# EasyEDA Pro project 12-5-3.3 card concept _panther_.epro

# Schematic Schematic1
Board Name: Board1; Create Date: 2025-04-18; Page Name: P1; Project Name: 5V3.3V PWR; Schematic Name: Schematic1; Update Date: 2025-04-18; Company: 嘉立创EDA; Page Size: A4; Version: V1.0
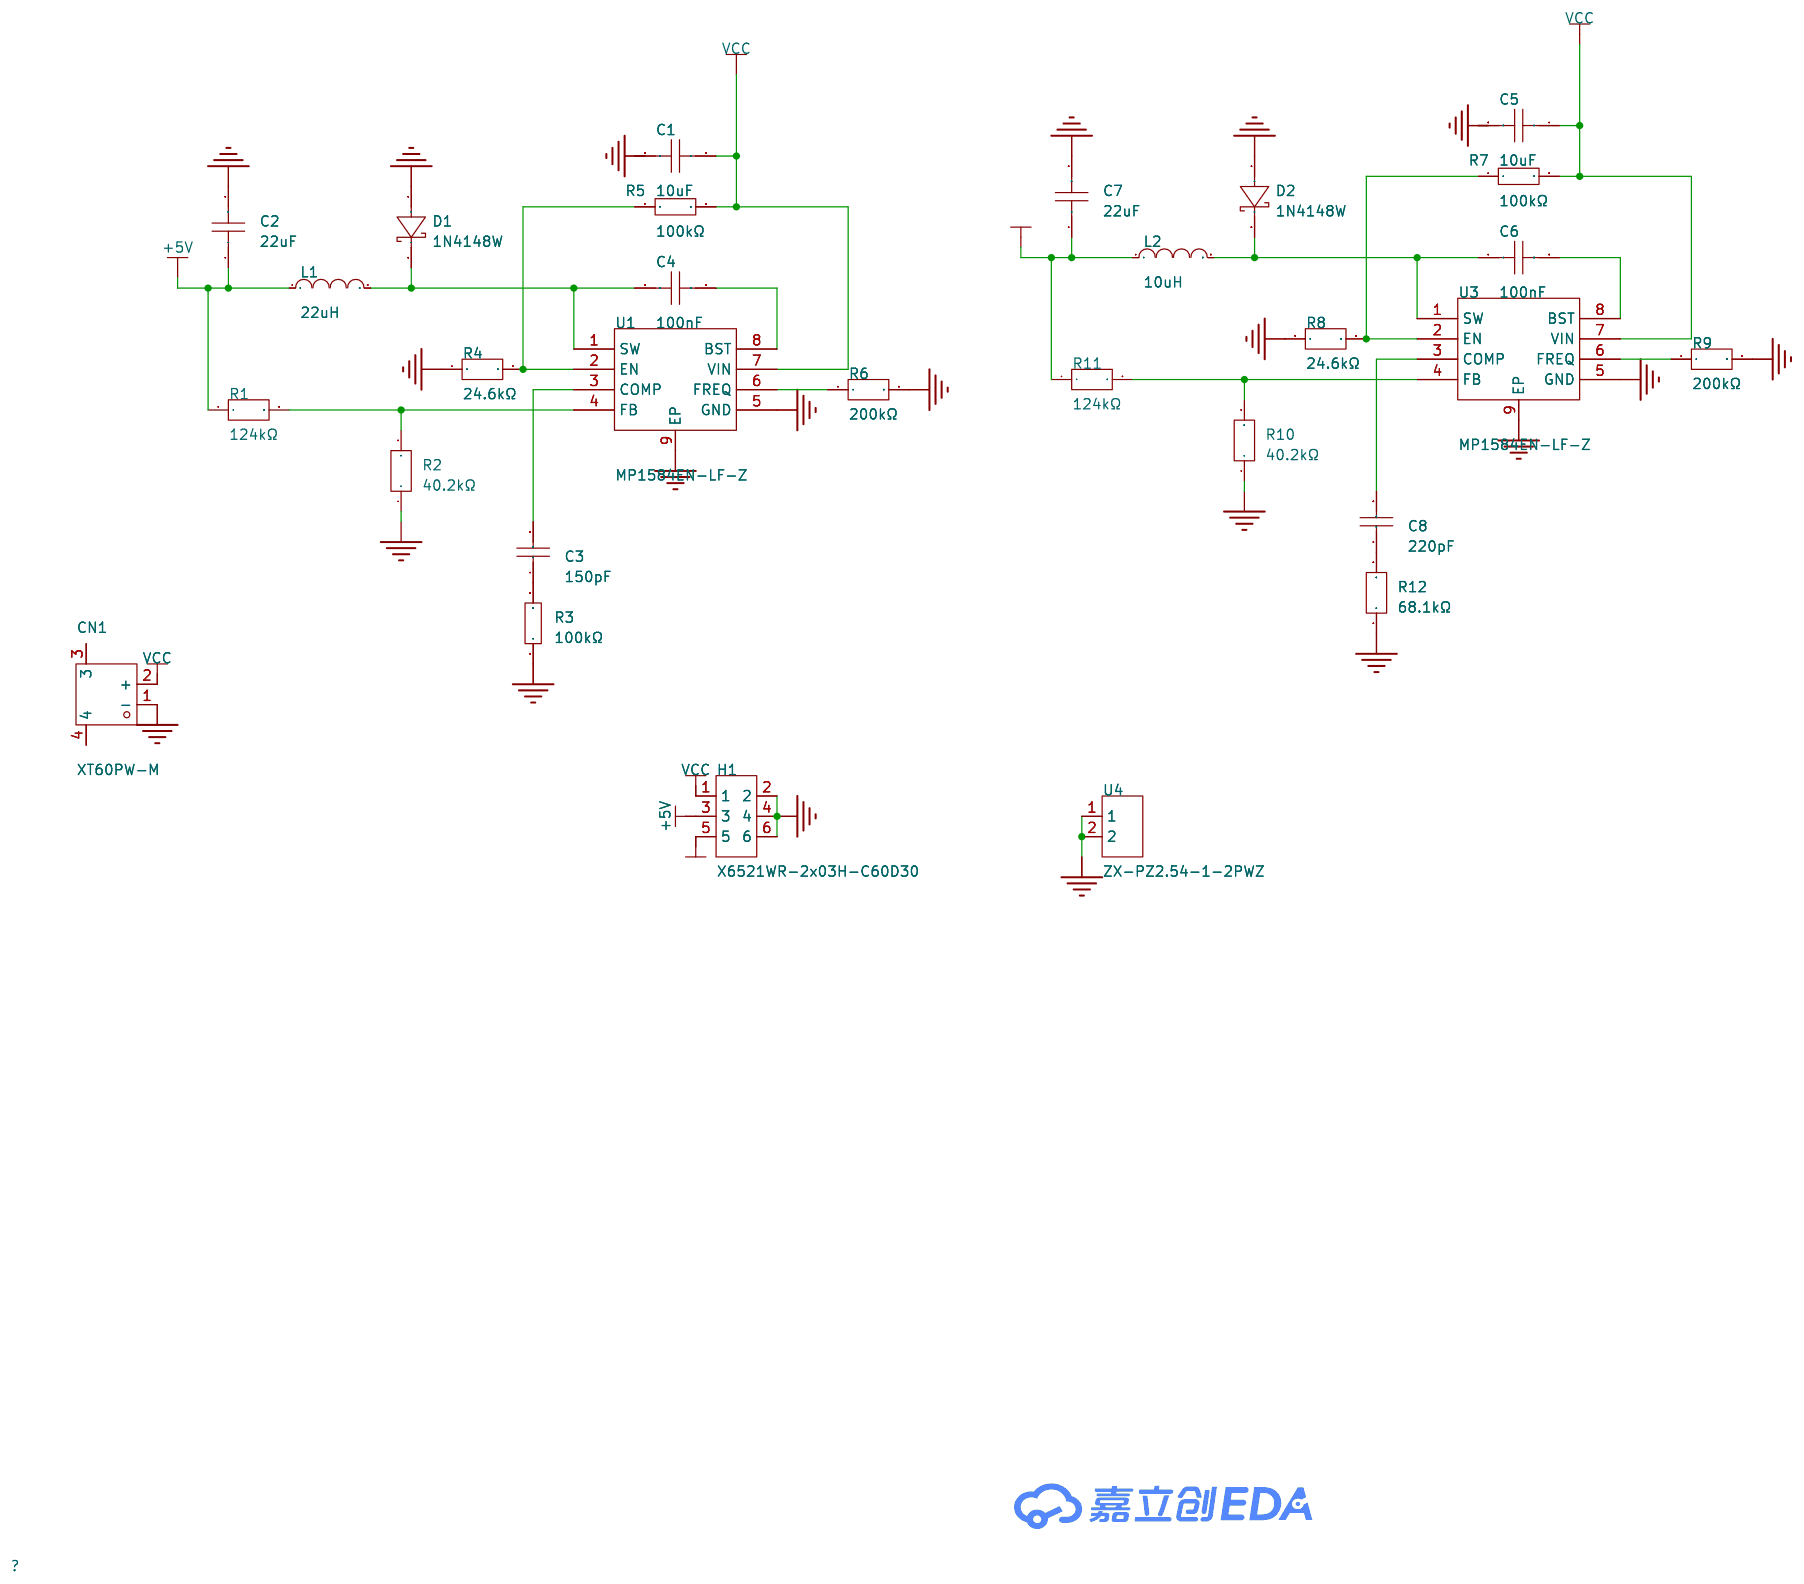
[diagram p0: schematic sheet]

## Parts
C1  10uF  [C1206]
C2  22uF  [C0805]
C3  150pF  [C0603]
C4  100nF  [C0603]
C5  10uF  [C1206]
C6  100nF  [C0603]
C7  22uF  [C0805]
C8  220pF  [C0603]
CN1  XT60PW-M  [CONN-TH_XT60PW-M]
D1  1N4148W  [SOD-123_L2.7-W1.6-LS3.7-FD]
D2  1N4148W  [SOD-123_L2.7-W1.6-LS3.7-FD]
H1  X6521WR-2x03H-C60D30  [HDR-TH_6P-P2.54-H-M-R2-C3-S2.54-W12.3-N]
L1  22uH  [IND-SMD_L7.0-W6.6_FXL0630]
L2  10uH  [IND-SMD_L7.3-W6.8]
R1  124kΩ  [R0603]
R2  40.2kΩ  [R0603]
R3  100kΩ  [R0603]
R4  24.6kΩ  [R0603]
R5  100kΩ  [R0603]
R6  200kΩ  [R0603]
R7  100kΩ  [R0603]
R8  24.6kΩ  [R0603]
R9  200kΩ  [R0603]
R10  40.2kΩ  [R0603]
R11  124kΩ  [R0603]
R12  68.1kΩ  [R0603]
U1  MP1584EN-LF-Z  [SOIC-8_L5.0-W4.0-P1.27-LS6.0-BL-EP2.0]
U3  MP1584EN-LF-Z  [SOIC-8_L5.0-W4.0-P1.27-LS6.0-BL-EP2.0]
U4  ZX-PZ2.54-1-2PWZ  [HDR-TH_2P-P2.54-H-M-W10.4]

## Library data of the parts
C1 C5 = HGC1206R5106K500NSPJ: 容值:10uF;精度:±10%;额定电压:50V;温度系数:X5R;; LCSC Part Name: 10uF ±10% 50V; Supplier Part: C7432781; Manufacturer: Chinocera(华瓷); Supplier Footprint: 1206; JLCPCB Part Class: 扩展库; Datasheet: https://atta.szlcsc.com/upload/public/pdf/source/20240320/FAC3FEC40A78BC5CCCE96C232A94D860.pdf; Supplier: LCSC; Tolerance: ±10%; Voltage Rating: 50V; Temperature Coefficient: X5R
C2 C7 = CGA0805X5R226M350MT: 容值:22uF;精度:±20%;额定电压:35V;材质(温度系数):X5R;; LCSC Part Name: 22uF ±20% 35V; Supplier Part: C6119901; Manufacturer: HRE(芯声); Supplier Footprint: 0805; JLCPCB Part Class: 扩展库; Datasheet: https://atta.szlcsc.com/upload/public/pdf/source/20231129/D589D0CC4D260F7AC3A77E53B455CCB3.pdf; Supplier: LCSC; Tolerance: ±20%; Voltage Rated: 35V; Temperature Coefficient: X5R
C3 = 0603B151K500NT: 容值:150pF;精度:±10%;额定电压:50V;温度系数:X7R;; LCSC Part Name: 150pF ±10% 50V; Supplier Part: C1594; Manufacturer: FH(风华); Supplier Footprint: 0603; JLCPCB Part Class: 基础库; Datasheet: https://atta.szlcsc.com/upload/public/pdf/source/20200305/C486355_26A10D38EF8C2A5C37091D0039909270.pdf; Supplier: LCSC; Tolerance: ±10%; Voltage Rating: 50V; Temperature Coefficient: X7R
C4 C6 = CGA0603X7R104K500JT: 容值:100nF;精度:±10%;额定电压:50V;材质(温度系数):X7R;; LCSC Part Name: 100nF ±10% 50V; Supplier Part: C6119867; Manufacturer: HRE(芯声); Supplier Footprint: 0603; JLCPCB Part Class: 扩展库; Supplier: LCSC; Tolerance: ±10%; Voltage Rated: 50V; Temperature Coefficient: X7R
C8 = CL10B221KB8NNNC: 容值:220pF;精度:±10%;额定电压:50V;材质(温度系数):X7R;; LCSC Part Name: 220pF ±10% 50V; Supplier Part: C1603; Manufacturer: SAMSUNG(三星); Supplier Footprint: 0603; JLCPCB Part Class: 基础库; Datasheet: https://atta.szlcsc.com/upload/public/pdf/source/20160218/1457707763339.pdf; Supplier: LCSC; Tolerance: ±10%; Voltage Rated: 50V; Temperature Coefficient: X7R
CN1 = XT60PW-M: 类别:-;类型1:-;; LCSC Part Name: AMASS(艾迈斯)航模插头xt60连接器150公母对接pw锂电池公头 板插卧式XT60PW-M; Supplier Part: C98732; Manufacturer: AMASS(艾迈斯); JLCPCB Part Class: 扩展库; Datasheet: https://atta.szlcsc.com/upload/public/pdf/source/20240118/44A3DCFF53BE25DC65378AFFB21277A4.pdf; Supplier: LCSC; Brand: 艾迈斯; Type: 卧式插头; Colour: 黄色; InterfaceType: 公头
D1 D2 = 1N4148W_C7420318: 二极管配置:独立式;正向压降(Vf):1.25V@150mA;直流反向耐压(Vr):100V;整流电流:150mA;反向恢复时间(trr):4ns;; Supplier Part: C7420318; Manufacturer: 宏迦橙; Supplier Footprint: SOD-123; JLCPCB Part Class: 扩展库; Datasheet: https://atta.szlcsc.com/upload/public/pdf/source/20230828/E5C3F7A4272052930A7E03B75759BF50.pdf; Supplier: LCSC; Diode Configuration: 独立式; Forward Voltage (Vf@If): 1.25V@150mA; Reverse Voltage (Vr): 100V; Rectified Current: 150mA; Reverse Leakage Current (Ir): 1uA@75V; Reverse Recovery Time (trr): 4ns; Operating Temperature: -55℃~+150℃
H1 = X6521WR-2x03H-C60D30: 插针结构:2x3P;间距:2.54mm;行距:2.54mm;圆针/方针:方针;排数:双排;总PIN位数:6P;额定电流:3A;额定电压:250V;配合针长度:-;塑高:2.5mm;端接针长度:-;触头材质:黄铜;触头镀层:金;工作温度:-40℃~+105℃;颜色:黑色;; LCSC Part Name: 2x3P 间距:2.54mm 方针; Supplier Part: C706884; Manufacturer: XKB Connection(中国星坤); Supplier Footprint: 弯插,P=2.54mm; JLCPCB Part Class: 扩展库; Datasheet: https://atta.szlcsc.com/upload/public/pdf/source/20230629/0A709C32132F66B6F68FAA8EED66C225.pdf; Supplier: LCSC; Pin Structure: 2x3P; Pitch: 2.54mm; Row Spacing: 2.54mm; Circluar Pins/Square Pins: 方针; Number of Rows: 双排; Number of Pins: 6P; Current Rating: 3A; Voltage Rating (Max): 250V; Insulation Height: 2.5mm; Contact Material: 黄铜; Contact Plating: 金; Operating Temperature: -40℃~+105℃; Color: 黑色
L1 = FXL0630-220-M: 电感值:22uH;精度:±20%;额定电流:2.5A;饱和电流(Isat):3A;类型:一体成型电感;; LCSC Part Name: 22uH ±20% 3A; Supplier Part: C177244; Manufacturer: cjiang(长江微电); Supplier Footprint: SMD,6.6x7mm; JLCPCB Part Class: 扩展库; Datasheet: https://atta.szlcsc.com/upload/public/pdf/source/20240426/3189EA8206330E2108542F9E34E540E7.pdf; Supplier: LCSC; Tolerance: ±20%; Rated Current: 2.5A; Saturation Current (Isat): 3A; DC Resistance (DCR): 200mΩ; Type: 一体成型电感
L2 = FXL0630-100-M: 电感值:10uH;精度:±20%;额定电流:4.5A;饱和电流(Isat):5.5A;类型:一体成型电感;; LCSC Part Name: 10uH ±20% 5.5A; Supplier Part: C167223; Manufacturer: cjiang(长江微电); Supplier Footprint: SMD,6.6x7mm; JLCPCB Part Class: Extended Part; Datasheet: https://atta.szlcsc.com/upload/public/pdf/source/20240426/3189EA8206330E2108542F9E34E540E7.pdf; Supplier: LCSC; Tolerance: ±20%; Rated Current: 4.5A; Saturation Current (Isat): 5.5A; DC Resistance (DCR): 68mΩ; Type: 一体成型电感
R1 R11 = FRC0603F1243TS: 电阻类型:厚膜电阻;阻值:124kΩ;精度:±1%;功率:100mW;最大工作电压:75V;温度系数:±100ppm/℃;; LCSC Part Name: 124kΩ ±1% 100mW 厚膜电阻; Supplier Part: C2933136; Manufacturer: FOJAN(富捷); Supplier Footprint: 0603; JLCPCB Part Class: 扩展库; Datasheet: https://atta.szlcsc.com/upload/public/pdf/source/20211221/925EC7D7225764EE0046F22065062C87.pdf; Supplier: LCSC; Type: 厚膜电阻; Tolerance: ±1%; Power(Watts): 100mW; Overload Voltage (Max): 75V; Temperature Coefficient: ±100ppm/℃; Operating Temperature Range: -55℃~+155℃
R2 R10 = FRC0603F4022TS: 电阻类型:厚膜电阻;阻值:40.2kΩ;精度:±1%;功率:100mW;最大工作电压:75V;温度系数:±100ppm/℃;; LCSC Part Name: 40.2kΩ ±1% 100mW 厚膜电阻; Supplier Part: C2933218; Manufacturer: FOJAN(富捷); Supplier Footprint: 0603; JLCPCB Part Class: 扩展库; Datasheet: https://atta.szlcsc.com/upload/public/pdf/source/20211221/925EC7D7225764EE0046F22065062C87.pdf; Supplier: LCSC; Type: 厚膜电阻; Tolerance: ±1%; Power(Watts): 100mW; Overload Voltage (Max): 75V; Temperature Coefficient: ±100ppm/℃; Operating Temperature Range: -55℃~+155℃
R3 R5 R7 = 0603WAF1003T5E: 电阻类型:厚膜电阻;阻值:100kΩ;精度:±1%;功率:100mW;最大工作电压:75V;温度系数:±100ppm/℃;; LCSC Part Name: 100kΩ ±1% 100mW 厚膜电阻; Supplier Part: C25803; Manufacturer: UNI-ROYAL(厚声); Supplier Footprint: 0603; JLCPCB Part Class: 基础库; Datasheet: https://atta.szlcsc.com/upload/public/pdf/source/20200306/C422600_1E6D84923E4A46A82E41ADD87F860B5C.pdf; Supplier: LCSC; Type: 厚膜电阻; Tolerance: ±1%; Power(Watts): 100mW; Overload Voltage (Max): 75V; Temperature Coefficient: ±100ppm/℃; Operating Temperature Range: -55℃~+155℃
R4 R8 = RT0603BRD0724K6L: 电阻类型:薄膜电阻;阻值:24.6kΩ;精度:±0.1%;功率:100mW;温度系数:±25ppm/℃;; LCSC Part Name: 薄膜电阻 24.6kΩ ±0.1% 100mW; Supplier Part: C861250; Manufacturer: YAGEO(国巨); Supplier Footprint: 0603; JLCPCB Part Class: Extended Part; Datasheet: https://atta.szlcsc.com/upload/public/pdf/source/20200610/C326738_5639A9F1B6EB6E4AE2197577D3456E7F.pdf; Supplier: LCSC; Type: 薄膜电阻; Tolerance: ±0.1%; Power(Watts): 100mW; Temperature Coefficient: ±25ppm/℃; Operating Temperature Range: -55℃~+155℃
R6 R9 = FRC0603F2003TS: 电阻类型:厚膜电阻;阻值:200kΩ;精度:±1%;功率:100mW;工作电压:75V;温度系数:±100ppm/℃;; LCSC Part Name: 200kΩ ±1% 100mW 厚膜电阻; Supplier Part: C2907009; Manufacturer: FOJAN(富捷); Supplier Footprint: 0603; JLCPCB Part Class: Extended Part; Datasheet: https://atta.szlcsc.com/upload/public/pdf/source/20211221/925EC7D7225764EE0046F22065062C87.pdf; Supplier: LCSC; Type: 厚膜电阻; Tolerance: ±1%; Power(Watts): 100mW; Voltage-Supply(Max): 75V; Temperature Coefficient: ±100ppm/℃; Operating Temperature: -55℃~+155℃
R12 = FRC0603F6812TS: 电阻类型:厚膜电阻;阻值:68.1kΩ;精度:±1%;功率:100mW;最大工作电压:75V;温度系数:±100ppm/℃;; LCSC Part Name: 68.1kΩ ±1% 100mW 厚膜电阻; Supplier Part: C2933251; Manufacturer: FOJAN(富捷); Supplier Footprint: 0603; JLCPCB Part Class: 扩展库; Datasheet: https://atta.szlcsc.com/upload/public/pdf/source/20211221/925EC7D7225764EE0046F22065062C87.pdf; Supplier: LCSC; Type: 厚膜电阻; Tolerance: ±1%; Power(Watts): 100mW; Overload Voltage (Max): 75V; Temperature Coefficient: ±100ppm/℃; Operating Temperature Range: -55℃~+155℃
U1 U3 = MP1584EN-LF-Z: 功能类型:降压型;输出类型:固定;工作电压:4.5V~28V;输出电压:800mV~25V;输出电流:3A;; LCSC Part Name: 3A、1.5MHz、28V降压转换器; Supplier Part: C15051; Manufacturer: MPS(芯源); Supplier Footprint: SOIC-8-EP; JLCPCB Part Class: 扩展库; Datasheet: https://atta.szlcsc.com/upload/public/pdf/source/20240315/437CA6FCECC7F1E554266F7D3B71CA0D.pdf; Supplier: LCSC; Function: 降压型; Output Type: 固定; Input Voltage: 4.5V~28V; Output Voltage: 800mV~25V; Output Current: 3A; Switching Frequency: 100kHz~1.5MHz; Operating Temperature: -20℃~+125℃; Synchronous Rectification: 否; Number of Outputs: 1; Topology: 降压式; Quiescent Current (Iq): 100uA; Switch tube (built-in/external): 内置
U4 = ZX-PZ2.54-1-2PWZ: 插针结构:1x2P;间距:2.54mm;行距:-;圆针/方针:方针;安装方式:弯插;排数:单排;总PIN位数:2P;额定电流:3A;额定电压:1kV;配合针长度:6mm;塑高:2.5mm;端接针长度:3mm;触头材质:黄铜;触头镀层:金;工作温度:-40℃~+105℃;颜色:黑色;; LCSC Part Name: 1x2P 间距:2.54mm 方针 弯插; Supplier Part: C7501290; Manufacturer: Megastar(兆星); Supplier Footprint: 弯插,P=2.54mm; JLCPCB Part Class: 扩展库; Datasheet: https://atta.szlcsc.com/upload/public/pdf/source/20231122/07546A4B2D2770522B3DC067FE340199.pdf; Supplier: LCSC; Pin Structure: 1x2P; Pitch: 2.54mm; Circluar Pins/Square Pins: 方针; Mounting Type: 弯插; Number of Rows: 单排; Number of Pins: 2P; Current Rating: 3A; Voltage Rating (Max): 1kV; Length of Mating Pin: 6mm; Insulation Height: 2.5mm; Length of End Connection Pin: 3mm; Contact Material: 黄铜; Contact Plating: 金; Operating Temperature: -40℃~+105℃; Color: 黑色

## Nets
+3.3V: C7.1 H1.5 L2.1 R11.1
+5V: C2.1 H1.3 L1.1 R1.1
GND: C1.2 C2.2 C5.2 C7.2 CN1.1(-) D1.1(A) D2.1(A) H1.2 H1.4 H1.6 R2.1 R3.1 R4.1 R6.2 R8.1 R9.2 R10.1 R12.1 U1.5(GND) U1.9(EP) U3.5(GND) U3.9(EP) U4.1 U4.2
VCC: C1.1 C5.1 CN1.2(+) H1.1 R5.2 R7.2 U1.7(VIN) U3.7(VIN)
$1N339: R4.2 R5.1 U1.2(EN)
$1N567: R6.1 U1.6(FREQ)
$1N752: C4.2 U1.8(BST)
$1N757: C4.1 D1.2(K) L1.2 U1.1(SW)
$1N1212: R1.2 R2.2 U1.4(FB)
$1N1263: C3.2 U1.3(COMP)
$1N1626: C3.1 R3.2
$1N2637: R7.1 R8.2 U3.2(EN)
$1N2645: R9.1 U3.6(FREQ)
$1N2651: C6.2 U3.8(BST)
$1N2654: C6.1 D2.2(K) L2.2 U3.1(SW)
$1N2671: R10.2 R11.2 U3.4(FB)
$1N2677: C8.2 U3.3(COMP)
$1N2890: C8.1 R12.2

Not connected (* = marked no-connect by the designer): CN1 3 4
